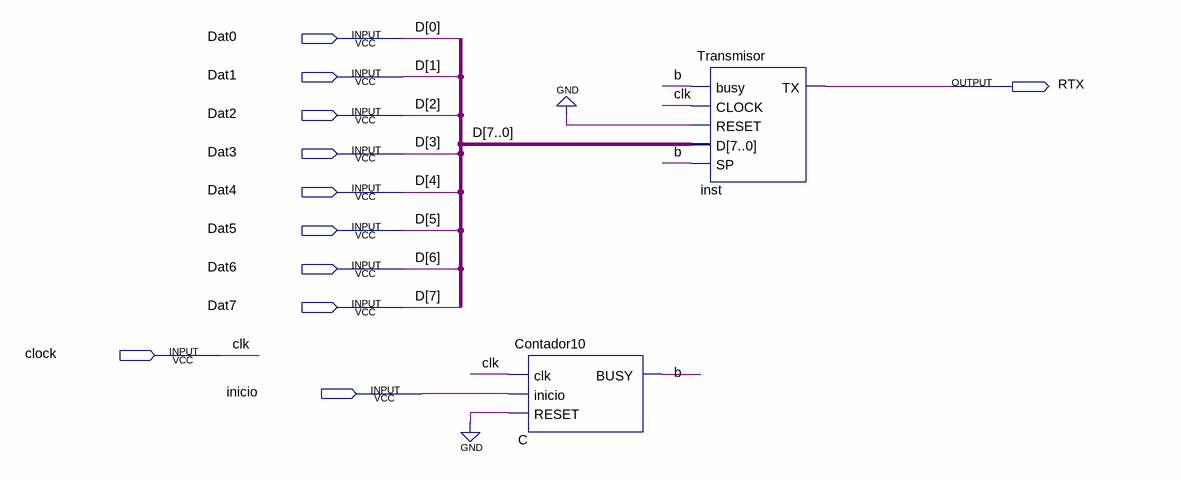
[diagram p0: schematic sheet]
// Quartus schematic UART5.bdf as structural Verilog: 2 symbols, 11 pins
module UART5 (
  input  Dat0,
  input  Dat1,
  input  Dat2,
  input  Dat3,
  input  Dat4,
  input  Dat5,
  input  Dat6,
  input  Dat7,
  input  clock,
  input  inicio,
  output RTX
);

  wire b;

  Contador10 C (.clk(clock), .inicio(inicio), .RESET(1'b0), .BUSY(b));
  Transmisor inst (
    .busy(b), .CLOCK(clock), .RESET(1'b0), .D({Dat7, Dat6, Dat5, Dat4, Dat3, Dat2, Dat1, Dat0}), .SP(b),
    .TX(RTX));

  // Other names for the same wires on the sheet: clk = clock;
  //   D[7:0] = {Dat7, Dat6, Dat5, Dat4, Dat3, Dat2, Dat1, Dat0}
endmodule
